# Altium project fmuvxX-baseT1.PrjPCB (part 1 of 3)
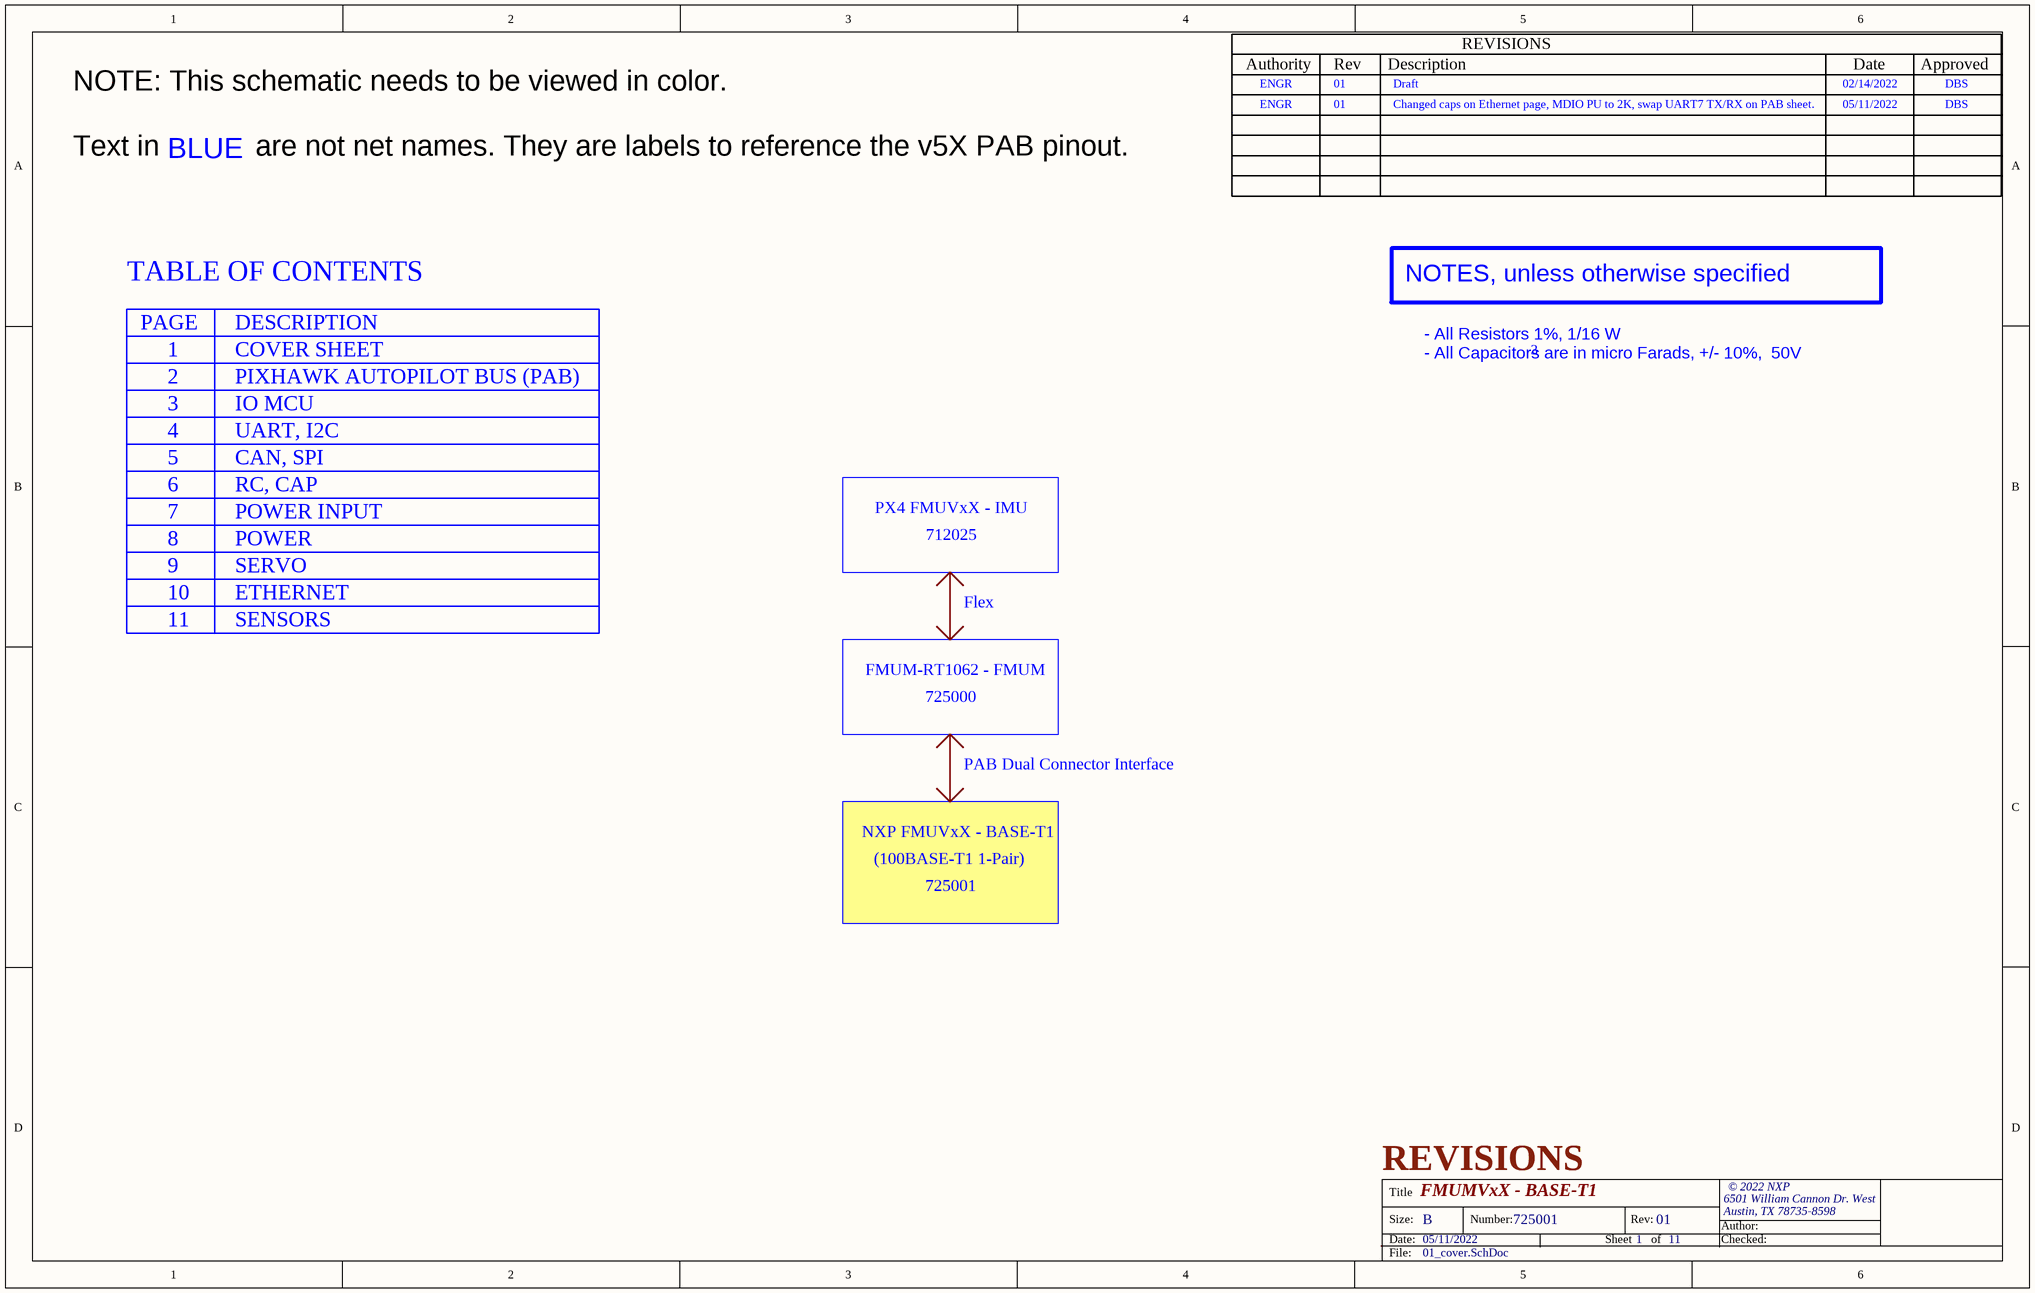
[diagram p0: 01_cover.SchDoc]
Proj_Title: FMUMVxX - BASE-T1; Proj_SheetTotal: 11; Proj_Revision: 01; Proj_Org_Address2: Austin, TX 78735-8598; Proj_Org_Address1: 6501 William Cannon Dr. West; Proj_Organization: © 2022 NXP; Proj_Number: 725001; Proj_Date: 05/11/2022; Proj_Checked: David Sidrane; Proj_Author: Dugan Yoon
7 sheets, 219 parts. Net scope: global (net labels, ports and power ports of the same name join across sheets).
Board file: fmuvxX-baseT1.PcbDoc
Sheets:
  01_cover.SchDoc
  02_PAB.SchDoc
  03_io_mcu.SchDoc
  05_can_spi.SchDoc
  08_power.SchDoc
  09_servo.SchDoc
  10_ethernet.SchDoc

## Sheet 01_cover.SchDoc: =Proj_Title
size B; Date: 05/11/2022; CheckedBy: David Sidrane; Author: Dugan Yoon; Organization: © 2022 NXP; Address1: Haleiwa, HI 96712 USA; DocumentNumber: 725001; Revision: 01; SheetNumber: 1; SheetTotal: 11

### Parts
*  REVISION_BLOCK  (value not drawn)  (graphical)

### Notes on the sheet
- (near *) ENGR
- 01
- Draft
- 02/14/2022
- DBS
- ENGR
- Changed caps on Ethernet page, MDIO PU to 2K, swap UART7 TX/RX on PAB sheet.
- 05/11/2022
- (near *) NOTE: This schematic needs to be viewed in color.
  Text in            are not net names. They are labels to reference the v5X PAB pinout.
- BLUE
- TABLE OF CONTENTS
- NOTES, unless otherwise specified
- PAGE
- 1
- DESCRIPTION
- COVER SHEET
- 3
- 2
- PIXHAWK AUTOPILOT BUS (PAB)
- IO MCU
- - All Resistors 1%, 1/16 W
  - All Capacitors are in micro Farads, +/- 10%,  50V
- 4
- 5
- 6
- UART, I2C
- CAN, SPI
- RC, CAP
- 7
- 8
- POWER INPUT
- POWER
- PX4 FMUVxX - IMU
- 712025
- 9
- 10
- 11
- SERVO
- ETHERNET
- SENSORS
- Flex
- FMUM-RT1062 - FMUM
- 725000
- PAB Dual Connector Interface
- NXP FMUVxX - BASE-T1
- (100BASE-T1 1-Pair)
- 725001
- REVISIONS
- Title
- Size:
- Date:
- B
- Number:
- Sheet
- Rev:
- of
- Author:
- Checked:
- File:
- (in symbol REVISION_BLOCK) REVISIONS; Authority; Rev; Description; Date; Approved

## Sheet 02_PAB.SchDoc: =Proj_Title
size B; Date: 05/11/2022; CheckedBy: David Sidrane; Author: Dugan Yoon; Organization: © 2022 NXP; Address1: Haleiwa, HI 96712 USA; DocumentNumber: 725001; Revision: 01; SheetNumber: 2; SheetTotal: 11
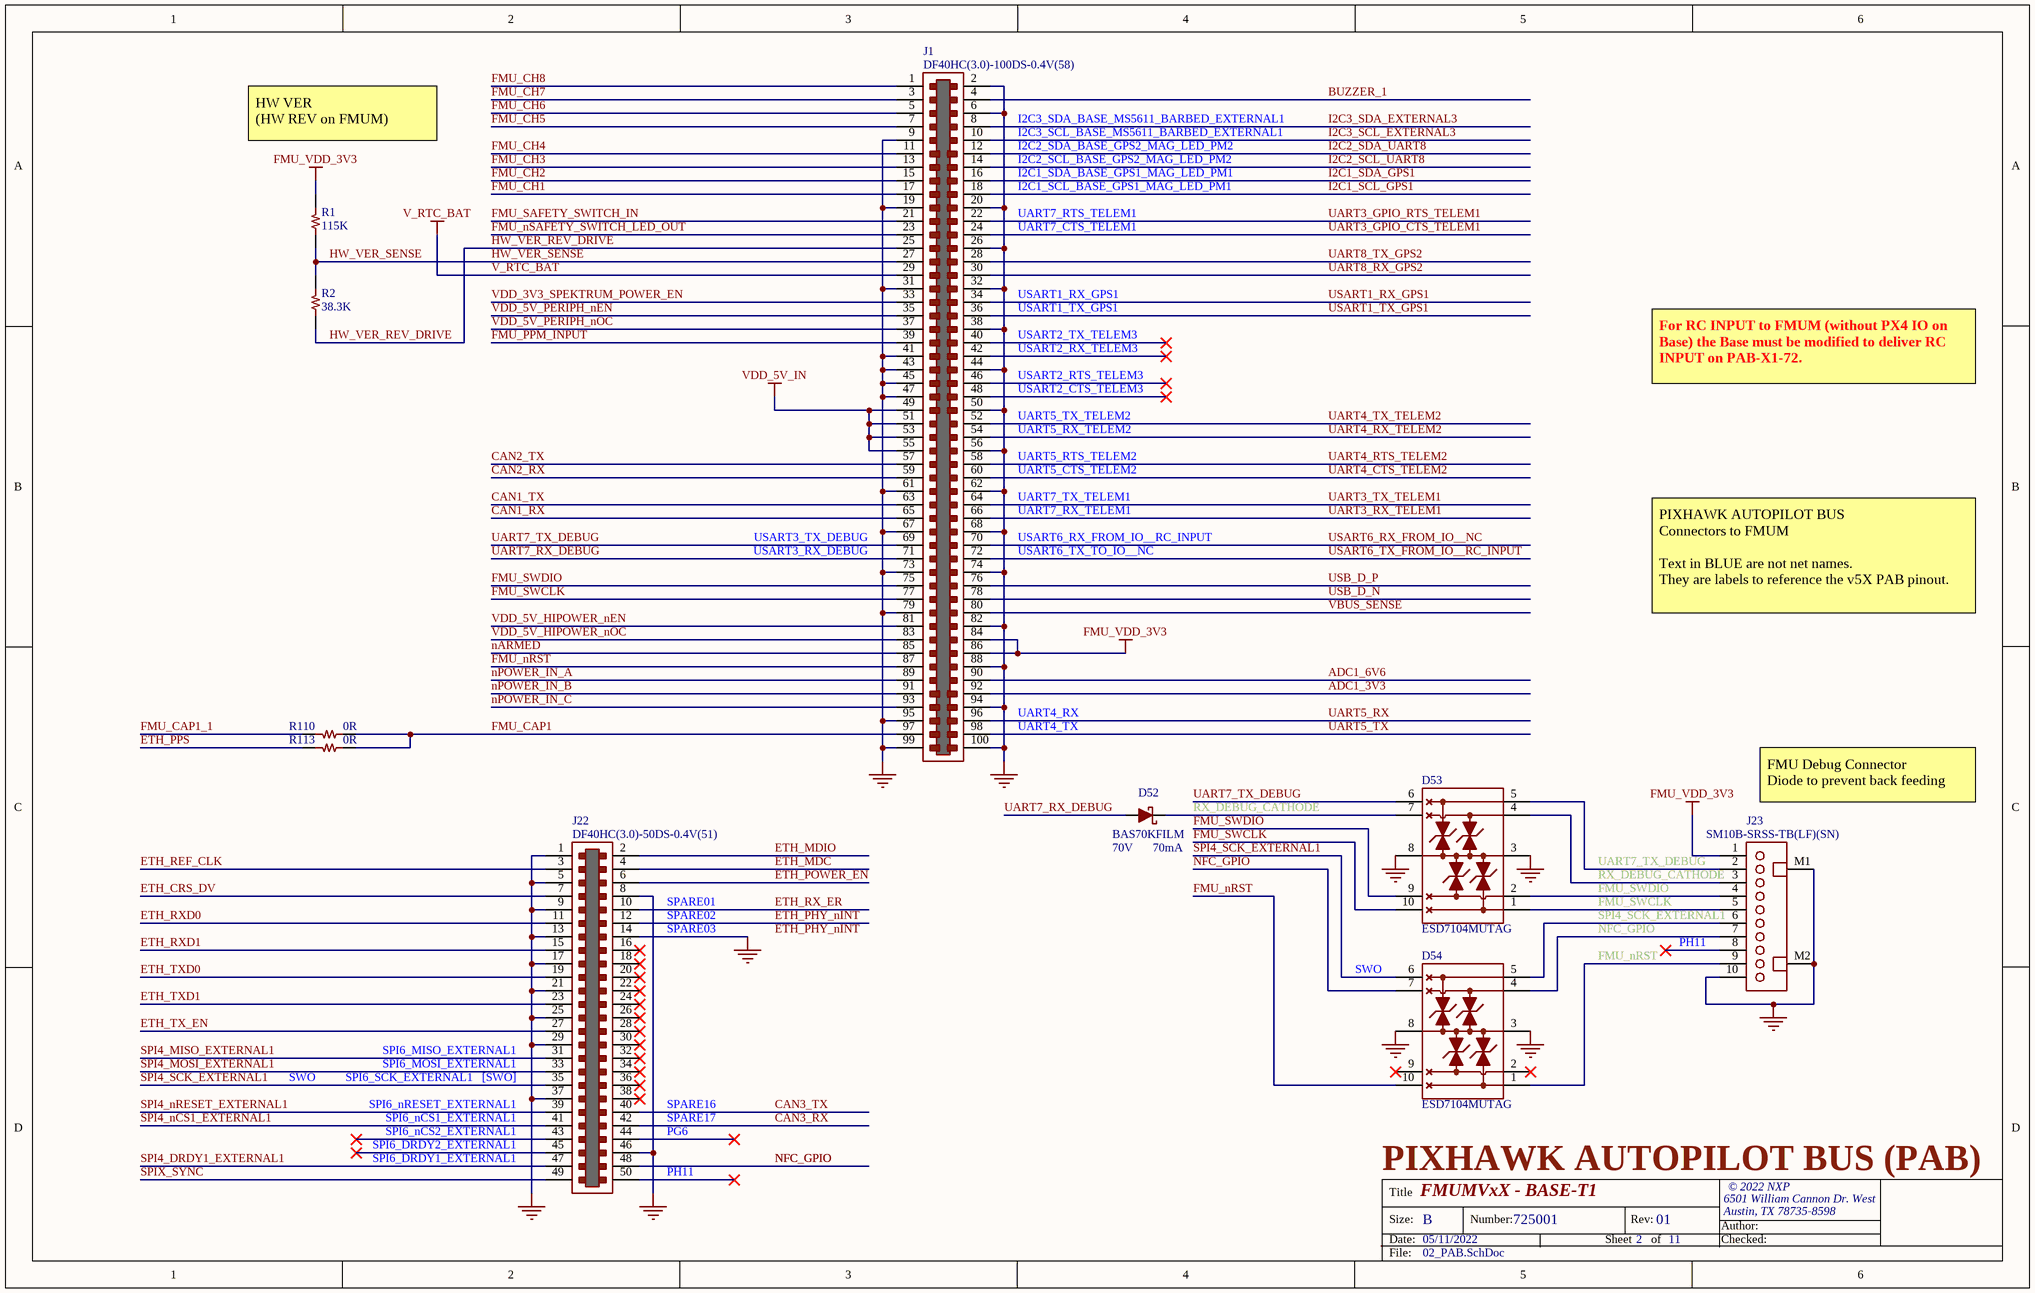
[diagram p1: 02_PAB.SchDoc]

### Parts
D52  Manufacturer Part Number: BAS70KFILM  Current: 70mA  Voltage: 70V  [SODFL120X80X70L30X30]  (hidden comment: DIODE SCHOTTKY 70V 70MA SOD523)
D53  Manufacturer Part Number: ESD7104MUTAG  [UDFN10P50_250X100X55L35X20N]  (hidden comment: DIODE TVS BIDIRECTIONAL 5V 10V 10UDFN)
D54  Manufacturer Part Number: ESD7104MUTAG  [UDFN10P50_250X100X55L35X20N]  (hidden comment: DIODE TVS BIDIRECTIONAL 5V 10V 10UDFN)
J1  Manufacturer Part Number: DF40HC(3.0)-100DS-0.4V(58)  [HIROSE_DF40HC3_0-100DS-0_4V51]  (hidden comment: CONN RCPT 100POS 0.4MM SMD GOLD)
J22  Manufacturer Part Number: DF40HC(3.0)-50DS-0.4V(51)  [HIROSE_DF40C-50DS-0-4V51]  (hidden comment: CONN RCPT 50POS 0.4MM SMD GOLD)
J23  Manufacturer Part Number: SM10B-SRSS-TB(LF)(SN)  [JST_SM10B-SRSS-TB]  (hidden comment: CONN HEADER SH 10POS SIDE 1MM SMT)
R1  value 115K  [RESC100X50X40L25]  (hidden comment: RES SMD 115K OHM 1% 1/16W 0402)
R2  value 38.3K  [RESC100X50X40L25]  (hidden comment: RES SMD 38.3K OHM 1% 1/16W 0402)
R110  value 0R  [RESC100X50X40L25]  (hidden comment: RES SMD 0 OHM 1% 1/16W 0402)
R113  value 0R  [RESC100X50X40L25]  (hidden comment: RES SMD 0 OHM 1% 1/16W 0402)

### Nets
FMU_VDD_3V3: J1.84 J1.86 J23.1 R1.1
GND: D53.3(GND) D53.8(GND) D54.3(GND) D54.8(GND) J1.2 J1.6 J1.9 J1.19 J1.20 J1.26 J1.31 J1.32 J1.38 J1.41 J1.43 J1.44 J1.45 J1.47 J1.50 J1.56 J1.61 J1.62 J1.67 J1.68 J1.73 J1.74 J1.79 J1.82 J1.88 J1.94 J1.95 J1.99 J1.100 J22.1 J22.5 J22.8 J22.9 J22.13 J22.14 J22.17 J22.21 J22.25 J22.29 J22.37 J22.46 J23.10 J23.M1 J23.M2
V_RTC_BAT: J1.29
VDD_5V_IN: J1.49 J1.51 J1.53 J1.55
ADC1_3V3: J1.92
ADC1_6V6: J1.90
BUZZER_1: J1.4
CAN1_RX: J1.65
CAN1_TX: J1.63
CAN2_RX: J1.59
CAN2_TX: J1.57
CAN3_RX: J22.42
CAN3_TX: J22.40
ETH_CRS_DV: J22.7
ETH_MDC: J22.4
ETH_MDIO: J22.2
ETH_PHY_nINT: J22.12
ETH_POWER_EN: J22.6
ETH_PPS: R113.1
ETH_REF_CLK: J22.3
ETH_RX_ER: J22.10
ETH_RXD0: J22.11
ETH_RXD1: J22.15
ETH_TX_EN: J22.27
ETH_TXD0: J22.19
ETH_TXD1: J22.23
FMU_CAP1: J1.97 R110.2 R113.2
FMU_CAP1_1: R110.1
FMU_CH1: J1.17
FMU_CH2: J1.15
FMU_CH3: J1.13
FMU_CH4: J1.11
FMU_CH5: J1.7
FMU_CH6: J1.5
FMU_CH7: J1.3
FMU_CH8: J1.1
FMU_nRST: D54.1 D54.10(NC) J1.87 J23.9
FMU_nSAFETY_SWITCH_LED_OUT: J1.23
FMU_PPM_INPUT: J1.39
FMU_SAFETY_SWITCH_IN: J1.21
FMU_SWCLK: D53.1 D53.10(NC) J1.77 J23.5
FMU_SWDIO: D53.2 D53.9(NC) J1.75 J23.4
HW_VER_REV_DRIVE: J1.25 R2.2
HW_VER_SENSE: J1.27 R1.2 R2.1
I2C1_SCL_GPS1: J1.18
I2C1_SDA_GPS1: J1.16
I2C2_SCL_UART8: J1.14
I2C2_SDA_UART8: J1.12
I2C3_SCL_EXTERNAL3: J1.10
I2C3_SDA_EXTERNAL3: J1.8
nARMED: J1.85
NFC_GPIO: D54.4 D54.7(NC) J22.48 J23.7
nPOWER_IN_A: J1.89
nPOWER_IN_B: J1.91
nPOWER_IN_C: J1.93
RX_DEBUG_CATHODE: D52.C D53.4 D53.7(NC) J23.3
SPI4_DRDY1_EXTERNAL1: J22.47
SPI4_MISO_EXTERNAL1: J22.31
SPI4_MOSI_EXTERNAL1: J22.33
SPI4_nCS1_EXTERNAL1: J22.41
SPI4_nRESET_EXTERNAL1: J22.39
SPI4_SCK_EXTERNAL1: D54.5 D54.6(NC) J22.35 J23.6
SPIX_SYNC: J22.49
UART3_GPIO_CTS_TELEM1: J1.24
UART3_GPIO_RTS_TELEM1: J1.22
UART3_RX_TELEM1: J1.66
UART3_TX_TELEM1: J1.64
UART4_CTS_TELEM2: J1.60
UART4_RTS_TELEM2: J1.58
UART4_RX_TELEM2: J1.54
UART4_TX_TELEM2: J1.52
UART5_RX: J1.96
UART5_TX: J1.98
UART7_RX_DEBUG: D52.A J1.71
UART7_TX_DEBUG: D53.5 D53.6(NC) J1.69 J23.2
UART8_RX_GPS2: J1.30
UART8_TX_GPS2: J1.28
USART1_RX_GPS1: J1.34
USART1_TX_GPS1: J1.36
USART6_RX_FROM_IO__NC: J1.70
USART6_TX_FROM_IO__RC_INPUT: J1.72
USB_D_N: J1.78
USB_D_P: J1.76
VBUS_SENSE: J1.80
VDD_3V3_SPEKTRUM_POWER_EN: J1.33
VDD_5V_HIPOWER_nEN: J1.81
VDD_5V_HIPOWER_nOC: J1.83
VDD_5V_PERIPH_nEN: J1.35
VDD_5V_PERIPH_nOC: J1.37

Not connected (* = marked no-connect by the designer): D54 2* 9(NC)*; J1 40* 42* 46* 48*; J22 16* 18* 20* 22* 24* 26* 28* 30* 32* 34* 36* 38* 43* 44* 45* 50*; J23 8*

### Notes on the sheet
- HW VER
  (HW REV on FMUM)
- I2C3_SDA_BASE_MS5611_BARBED_EXTERNAL1
- I2C3_SCL_BASE_MS5611_BARBED_EXTERNAL1
- I2C2_SDA_BASE_GPS2_MAG_LED_PM2
- I2C2_SCL_BASE_GPS2_MAG_LED_PM2
- UART7_RTS_TELEM1
- I2C1_SDA_BASE_GPS1_MAG_LED_PM1
- I2C1_SCL_BASE_GPS1_MAG_LED_PM1
- UART7_CTS_TELEM1
- USART1_RX_GPS1
- USART1_TX_GPS1
- USART2_TX_TELEM3
- USART2_RX_TELEM3
- USART2_RTS_TELEM3
- USART2_CTS_TELEM3
- UART5_TX_TELEM2
- UART5_RX_TELEM2
- For RC INPUT to FMUM (without PX4 IO on Base) the Base must be modified to deliver RC INPUT on PAB-X1-72.
- UART5_RTS_TELEM2
- UART5_CTS_TELEM2
- UART7_TX_TELEM1
- USART3_TX_DEBUG
- USART3_RX_DEBUG
- UART7_RX_TELEM1
- USART6_RX_FROM_IO__RC_INPUT
- USART6_TX_TO_IO__NC
- PIXHAWK AUTOPILOT BUS
  Connectors to FMUM
  Text in BLUE are not net names.
  They are labels to reference the v5X PAB pinout.
- UART4_RX
- UART4_TX
- FMU Debug Connector
  Diode to prevent back feeding
- SPARE01
- SPARE02
- SPARE03
- SWO
- (near J23) PH11
- SPI6_MISO_EXTERNAL1
- SPI6_MOSI_EXTERNAL1
- SPI6_SCK_EXTERNAL1   [SWO]
- SPI6_nRESET_EXTERNAL1
- SPARE16
- SPI6_nCS1_EXTERNAL1
- SPI6_nCS2_EXTERNAL1
- SPI6_DRDY2_EXTERNAL1
- SPI6_DRDY1_EXTERNAL1
- SPARE17
- PG6
- PH11
- PIXHAWK AUTOPILOT BUS (PAB)
- Labels drawn without touching a wire or pin: ETH_PHY_nINT
- Title
- Size:
- Date:
- B
- Number:
- Sheet
- Rev:
- of
- Author:
- Checked:
- File:

### Library data of the parts
D52 = DIODE_SCHOTTKY_BAS70_SOD523_SMT: Manufacturer: STMicroelectronics; Packaging: Cut Tape (CT); Part Status: Active; Supplier 1: Digi-Key; Supplier Part Number 1: 497-5695-1-ND; Category: Discrete Semiconductor Products; Stock 1: 20067; Pricing 1: 1=0.28, 10=0.23, 100=0.122, 500=0.08028, 1000=0.05459 (USD); ComponentLink1Description: https://www.digikey.com/product-detail/en/stmicroelectronics/BAS70KFILM/497-5695-1-ND/1299948; ComponentLink1URL: https://www.digikey.com/product-detail/en/stmicroelectronics/BAS70KFILM/497-5695-1-ND/1299948
D53 D54 = DIODE_TVS_4X_10UDFN: Manufacturer: ON Semiconductor; Packaging: Cut Tape (CT); Part Status: Active; Operating Temperature: -55°C ~ 125°C (TJ); Supplier 1: Digi-Key; Supplier Part Number 1: ESD7104MUTAGOSCT-ND; Category: Circuit Protection; Stock 1: 5750; Pricing 1: 1=0.63, 10=0.541, 100=0.40370, 500=0.31716, 1000=0.24508 (USD); ComponentLink1Description: https://www.digikey.com/product-detail/en/on-semiconductor/ESD7104MUTAG/ESD7104MUTAGOSCT-ND/3487538; ComponentLink1URL: https://www.digikey.com/product-detail/en/on-semiconductor/ESD7104MUTAG/ESD7104MUTAGOSCT-ND/3487538
J1 = CONN_RCPT_2X50_RECPT_0.4MM_SMD: Manufacturer: Hirose Electric Co Ltd; Number of Positions: 100; Pitch: 0.016" (0.40mm); System: Connector; Mated Stacking Heights: 3mm; Packaging: Cut Tape (CT); Part Status: Active; Number of Rows: 2; Mounting Type: Surface Mount; Operating Temperature: -65°C ~ 85°C; Supplier 1: Digi-Key; Supplier Part Number 1: H124602CT-ND; Category: Connectors, Interconnects; Stock 1: 2220; Pricing 1: 1=2.75 (USD); ComponentLink1Description: https://www.digikey.com/products/en/connectors-interconnects/rectangular-connectors-arrays-edge-type-mezzanine-board-to-board/308?k=df40hc%283.0%29-100&k=&pkeyword=df40hc%283.0%29-100&sv=0&pv7=2&sf=0&quantity=&ColumnSort=0&page=1&pageSize=25; ComponentLink1URL: https://www.digikey.com/products/en/connectors-interconnects/rectangular-connectors-arrays-edge-type-mezzanine-board-to-board/308?k=df40hc%283.0%29-100&k=&pkeyword=df40hc%283.0%29-100&sv=0&pv7=2&sf=0&quantity=&ColumnSort=0&page=1&pageSize=25
J22 = CONN_RCPT_2X25_RECPT_0.4MM_SMD: Manufacturer: Hirose Electric Co Ltd; Number of Positions: 50; Pitch: 0.016" (0.40mm); System: Connector; Mated Stacking Heights: 3mm; Packaging: Cut Tape (CT); Part Status: Active; Number of Rows: 2; Mounting Type: Surface Mount; Operating Temperature: -65°C ~ 85°C; Supplier 1: Digi-Key; Supplier Part Number 1: H11915CT-ND; Category: Connectors, Interconnects; Stock 1: 8712; Pricing 1: 1=1.05, 10=0.926, 25=0.8712, 50=0.835, 100=0.7986, 250=0.726, 500=0.6534, 1000=0.5808 (USD); ComponentLink1Description: https://www.digikey.com/products/en/connectors-interconnects/rectangular-connectors-arrays-edge-type-mezzanine-board-to-board/308?k=DF40HC%283.0%29-50DS-0.4V%2851%29&k=&pkeyword=DF40HC%283.0%29-50DS-0.4V%2851%29&sv=0&pv7=2&sf=0&quantity=&ColumnSort=0&page=1&pageSize=25; ComponentLink1URL: https://www.digikey.com/products/en/connectors-interconnects/rectangular-connectors-arrays-edge-type-mezzanine-board-to-board/308?k=DF40HC%283.0%29-50DS-0.4V%2851%29&k=&pkeyword=DF40HC%283.0%29-50DS-0.4V%2851%29&sv=0&pv7=2&sf=0&quantity=&ColumnSort=0&page=1&pageSize=25
J23 = CONN_JST_SH_10PIN_RA_SMT: Manufacturer: JST Sales America Inc.; Voltage - Rated: 50V; System: Connector; Packaging: Cut Tape (CT); Part Status: Active; Operating Temperature: -25°C ~ 85°C; Supplier 1: Digi-Key; Supplier Part Number 1: 455-1810-1-ND; Category: Connectors, Interconnects; Stock 1: 62595; Pricing 1: 1=1.06, 10=9.32, 100=0.8037, 500=0.65758, 1000=0.58452 (USD); ComponentLink1Description: https://www.digikey.com/products/en/connectors-interconnects/rectangular-connectors-headers-male-pins/314?k=SM10B-SRSS&k=&pkeyword=SM10B-SRSS&pv1989=0&sf=0&FV=ffe0013a%2C1c0002&quantity=&ColumnSort=0&page=1&pageSize=25; ComponentLink1URL: https://www.digikey.com/products/en/connectors-interconnects/rectangular-connectors-headers-male-pins/314?k=SM10B-SRSS&k=&pkeyword=SM10B-SRSS&pv1989=0&sf=0&FV=ffe0013a%2C1c0002&quantity=&ColumnSort=0&page=1&pageSize=25
R1 = RES_115K_1%_1/16W_0402: Manufacturer: Vishay Dale; Manufacturer Part Number: CRCW0402115KFKED; Packaging: Cut Tape (CT); Part Status: Active; Tolerance: ±1%; Operating Temperature: -55°C ~ 155°C; Supplier 1: Digi-Key; Supplier Part Number 1: 541-115KLCT-ND; Category: Resistors; Stock 1: 32374; Pricing 1: 1=0.1, 10=0.014, 100=0.0056, 1000=0.00253, 2500=0.0022, 5000=0.00181 (USD); Power: 1/16W; ComponentLink1Description: https://www.digikey.com/products/en/resistors/chip-resistor-surface-mount/52?k=&pkeyword=&sv=0&v=541&pv2085=u115+kOhms&sf=0&FV=2%7C7854%2C3%7C1131%2C7%7C2%2C1989%7C0%2C-8%7C52%2C174%7C411742&quantity=&ColumnSort=0&page=1&pageSize=25; ComponentLink1URL: https://www.digikey.com/products/en/resistors/chip-resistor-surface-mount/52?k=&pkeyword=&sv=0&v=541&pv2085=u115+kOhms&sf=0&FV=2%7C7854%2C3%7C1131%2C7%7C2%2C1989%7C0%2C-8%7C52%2C174%7C411742&quantity=&ColumnSort=0&page=1&pageSize=25
R2 = RES_38.3K_1%_1/16W_0402: Manufacturer: Yageo; Manufacturer Part Number: RC0402FR-0738K3L; Packaging: Cut Tape (CT); Part Status: Active; Tolerance: ±1%; Operating Temperature: -55°C ~ 155°C; Supplier 1: Digi-Key; Supplier Part Number 1: YAG3141CT-ND; Category: Resistors; Stock 1: 92389; Pricing 1: 1=0.1, 10=0.014, 100=0.0056, 1000=0.00253, 2500=0.0022, 5000=0.00181 (USD); Power: 1/16W; ComponentLink1Description: https://www.digikey.com/products/en/resistors/chip-resistor-surface-mount/52?k=RC0402FR-0738K3L&k=&pkeyword=RC0402FR-0738K3L&sv=0&pv7=2&sf=0&quantity=&ColumnSort=0&page=1&pageSize=25; ComponentLink1URL: https://www.digikey.com/products/en/resistors/chip-resistor-surface-mount/52?k=RC0402FR-0738K3L&k=&pkeyword=RC0402FR-0738K3L&sv=0&pv7=2&sf=0&quantity=&ColumnSort=0&page=1&pageSize=25
R110 R113 = RES_0R_1%_1/16W_0402: Manufacturer: Yageo; Manufacturer Part Number: RC0402JR-070RL; Packaging: Cut Tape (CT); Part Status: Active; Tolerance: ±1%; Operating Temperature: -55°C ~ 155°C; Supplier 1: Digi-Key; Supplier Part Number 1: 311-0.0JRCT-ND; Category: Resistors; Stock 1: 34962204; Pricing 1: 1=0.1, 10=0.014, 100=0.0056, 1000=0.00253, 2500=0.0022, 5000=0.00181 (USD); Power: 1/16W; ComponentLink1Description: https://www.digikey.com/product-detail/en/yageo/RC0402JR-070RL/311-0.0JRCT-ND/729353; ComponentLink1URL: https://www.digikey.com/product-detail/en/yageo/RC0402JR-070RL/311-0.0JRCT-ND/729353

## Sheet 03_io_mcu.SchDoc: =Proj_Title
size B; Date: 05/11/2022; CheckedBy: David Sidrane; Author: Dugan Yoon; Organization: © 2022 NXP; Address1: Giesshuebelstrasse 40; Address2: 8045 Zurich, Switzerland; DocumentNumber: 725001; Revision: 01; SheetNumber: 3; SheetTotal: 11
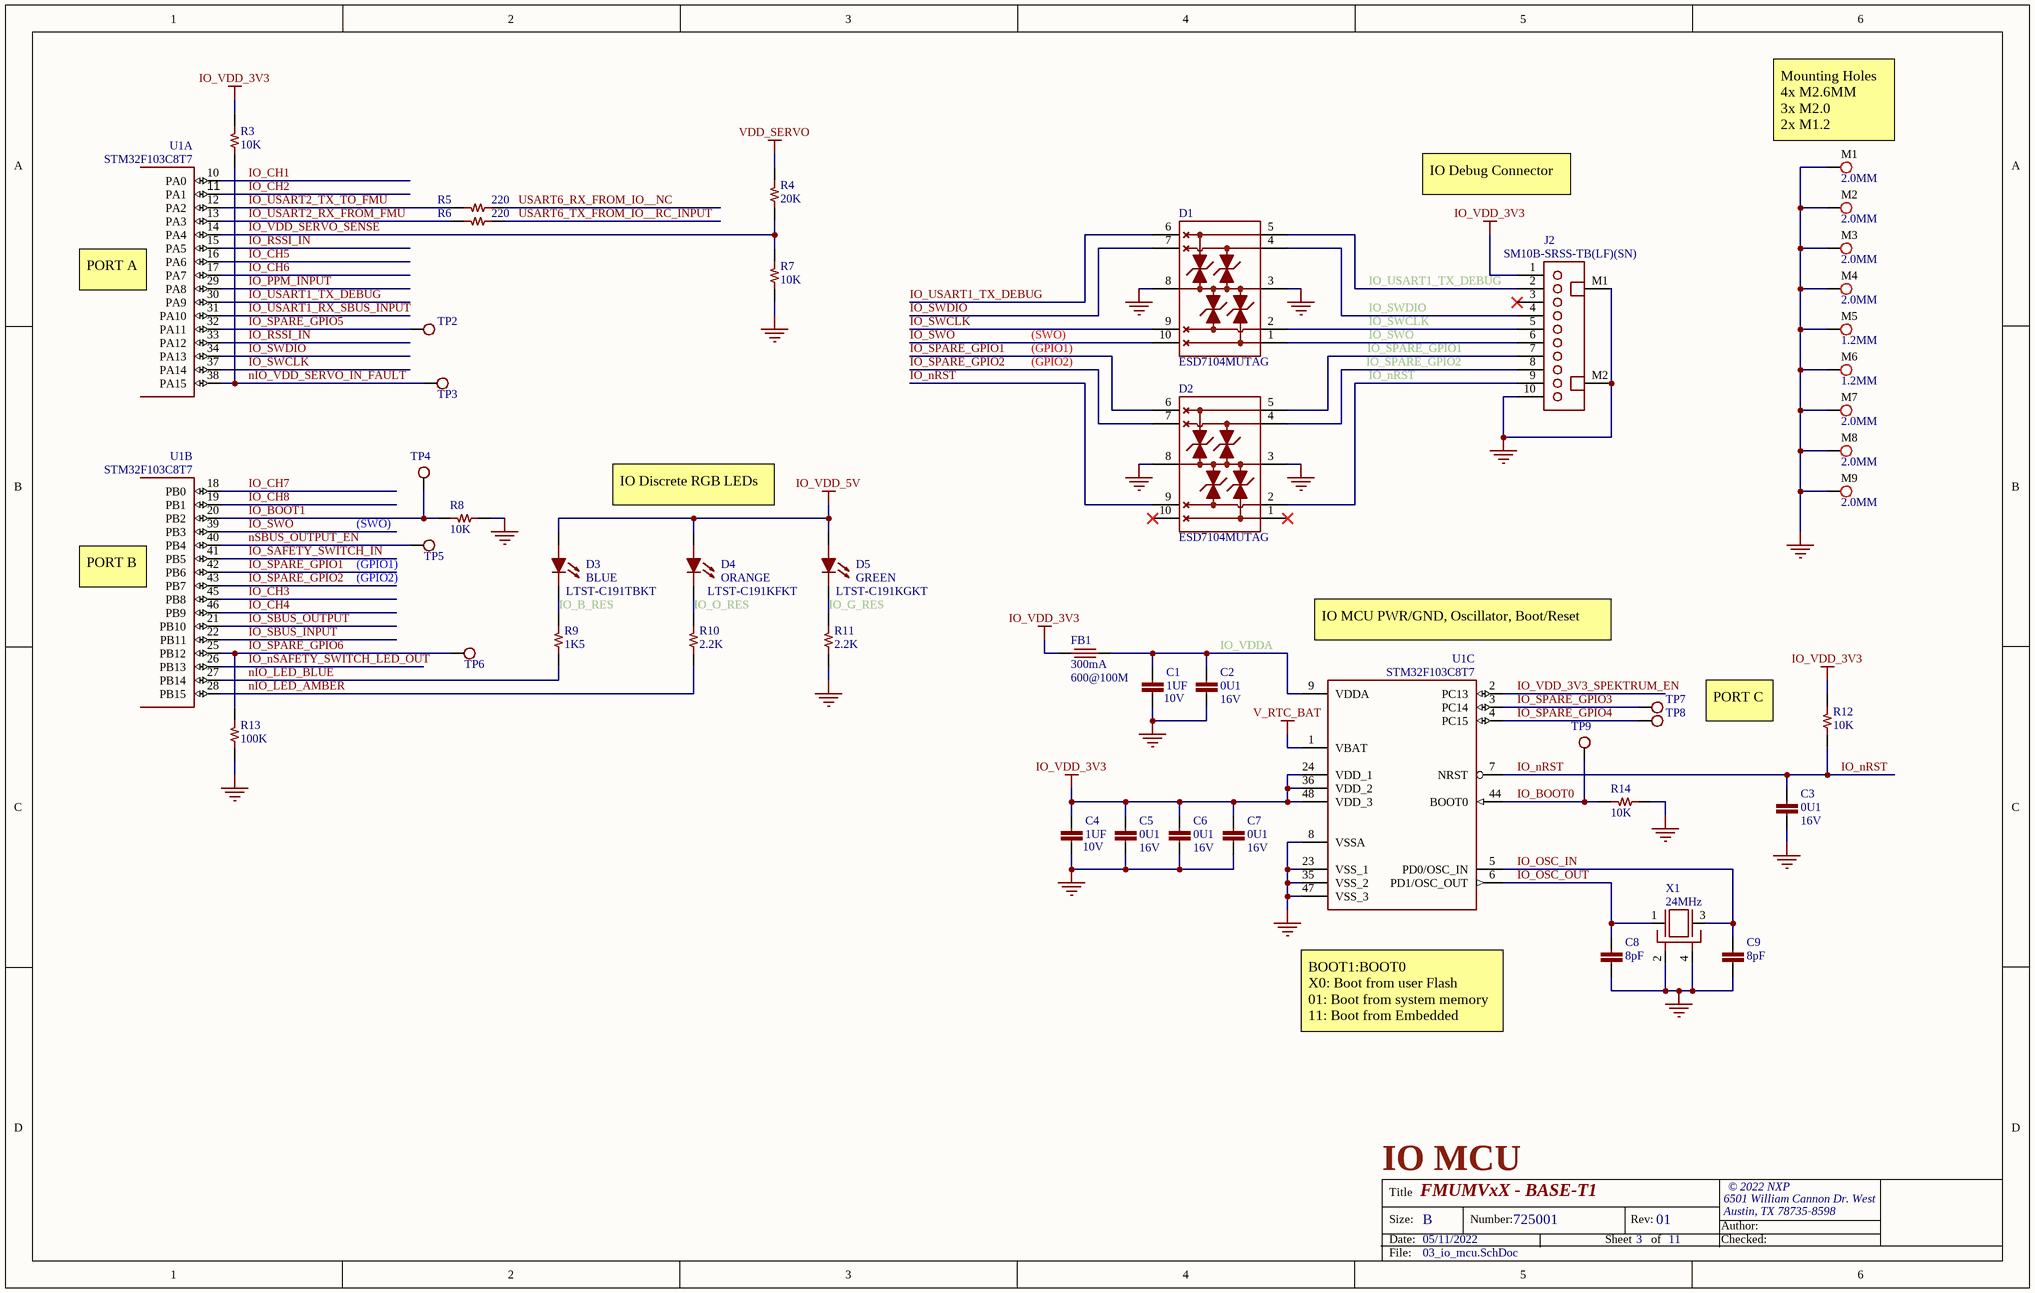
[diagram p2: 03_io_mcu.SchDoc]

### Parts
C1  value 1UF  Voltage - Rated: 10V  [CAPC100X50X56L25N]  (hidden comment: CAP CER 1UF 20% 10V X5R 0402)
C2  value 0U1  Voltage - Rated: 16V  [CAPC100X50X56L25N]  (hidden comment: CAP CER 0.1UF 10% 16V X7R 0402)
C3  value 0U1  Voltage - Rated: 16V  [CAPC100X50X56L25N]  (hidden comment: CAP CER 0.1UF 10% 16V X7R 0402)
C4  value 1UF  Voltage - Rated: 10V  [CAPC100X50X56L25N]  (hidden comment: CAP CER 1UF 20% 10V X5R 0402)
C5  value 0U1  Voltage - Rated: 16V  [CAPC100X50X56L25N]  (hidden comment: CAP CER 0.1UF 10% 16V X7R 0402)
C6  value 0U1  Voltage - Rated: 16V  [CAPC100X50X56L25N]  (hidden comment: CAP CER 0.1UF 10% 16V X7R 0402)
C7  value 0U1  Voltage - Rated: 16V  [CAPC100X50X56L25N]  (hidden comment: CAP CER 0.1UF 10% 16V X7R 0402)
C8  value 8pF  [CAPC100X50X56L25N]  (hidden comment: CAP CER 8PF 50V C0G/NP0 0402)
C9  value 8pF  [CAPC100X50X56L25N]  (hidden comment: CAP CER 8PF 50V C0G/NP0 0402)
D1  Manufacturer Part Number: ESD7104MUTAG  [UDFN10P50_250X100X55L35X20N]  (hidden comment: DIODE TVS BIDIRECTIONAL 5V 10V 10UDFN)
D2  Manufacturer Part Number: ESD7104MUTAG  [UDFN10P50_250X100X55L35X20N]  (hidden comment: DIODE TVS BIDIRECTIONAL 5V 10V 10UDFN)
D3  Color: BLUE  Manufacturer Part Number: LTST-C191TBKT  [LEDSC80X160X65L40N_BLU]  (hidden comment: LED BLUE CLEAR 0603 SMD)
D4  Color: ORANGE  Manufacturer Part Number: LTST-C191KFKT  [LEDSC80X160X65L40N_ORA]  (hidden comment: LED ORANGE CLEAR 0603 SMD)
D5  Color: GREEN  Manufacturer Part Number: LTST-C191KGKT  [LEDSC80X160X65L40N_GRN]  (hidden comment: LED GREEN CLEAR 0603 SMD)
FB1  value 600@100M  Current: 300mA  [BEADC100X50X55L25]  (hidden comment: IND FERRITE 600@100M 300mA 0402)
J2  Manufacturer Part Number: SM10B-SRSS-TB(LF)(SN)  [JST_SM10B-SRSS-TB]  (hidden comment: CONN HEADER SH 10POS SIDE 1MM SMT)
M1  ID: 2.0MM  [MOUNT_HOLE_2MM_3.6MM_8via_TH]  (hidden comment: MOUNT HOLE 2MM 3.6MM 8VIAS TH)  (no BOM)
M2  ID: 2.0MM  [MOUNT_HOLE_2MM_3.6MM_8via_TH]  (hidden comment: MOUNT HOLE 2MM 3.6MM 8VIAS TH)  (no BOM)
M3  ID: 2.0MM  [MOUNT_HOLE_2MM_3.6MM_8via_TH]  (hidden comment: MOUNT HOLE 2MM 3.6MM 8VIAS TH)  (no BOM)
M4  ID: 2.0MM  [MOUNT_HOLE_2MM_3.6MM_8via_TH]  (hidden comment: MOUNT HOLE 2MM 3.6MM 8VIAS TH)  (no BOM)
M5  ID: 1.2MM  [MOUNT_HOLE_1.2MM_TH]  (hidden comment: MOUNT HOLE 1.2MM TH)  (no BOM)
M6  ID: 1.2MM  [MOUNT_HOLE_1.2MM_TH]  (hidden comment: MOUNT HOLE 1.2MM TH)  (no BOM)
M7  ID: 2.0MM  [MOUNT_HOLE_2MM_3.6MM_8via_TH]  (hidden comment: MOUNT HOLE 2MM 3.6MM 8VIAS TH)  (no BOM)
M8  ID: 2.0MM  [MOUNT_HOLE_2MM_3.6MM_8via_TH]  (hidden comment: MOUNT HOLE 2MM 3.6MM 8VIAS TH)  (no BOM)
M9  ID: 2.0MM  [MOUNT_HOLE_2MM_3.6MM_8via_TH]  (hidden comment: MOUNT HOLE 2MM 3.6MM 8VIAS TH)  (no BOM)
R3  value 10K  [RESC100X50X40L25]  (hidden comment: RES SMD 10K OHM 1% 1/16W 0402)
R4  value 20K  [RESC100X50X40L25]  (hidden comment: RES SMD 20K OHM 1% 1/16W 0402)
R5  value 220  [RESC100X50X40L25]  (hidden comment: RES SMD 220 OHM 1% 1/16W 0402)
R6  value 220  [RESC100X50X40L25]  (hidden comment: RES SMD 220 OHM 1% 1/16W 0402)
R7  value 10K  [RESC100X50X40L25]  (hidden comment: RES SMD 10K OHM 1% 1/16W 0402)
R8  value 10K  [RESC100X50X40L25]  (hidden comment: RES SMD 10K OHM 1% 1/16W 0402)
R9  value 1K5  [RESC100X50X40L25]  (hidden comment: RES SMD 1.5K OHM 1% 1/16W 0402)
R10  value 2.2K  [RESC100X50X40L25]  (hidden comment: RES SMD 2.2K OHM 1% 1/16W 0402)
R11  value 2.2K  [RESC100X50X40L25]  (hidden comment: RES SMD 2.2K OHM 1% 1/16W 0402)
R12  value 10K  [RESC100X50X40L25]  (hidden comment: RES SMD 10K OHM 1% 1/16W 0402)
R13  value 100K  [RESC100X50X40L25]  (hidden comment: RES SMD 100K OHM 1% 1/16W 0402)
R14  value 10K  [RESC100X50X40L25]  (hidden comment: RES SMD 10K OHM 1% 1/16W 0402)
TP2  TESTPOINT PAD SMD  [TEST_PAD_1MM]  (value not drawn)  (no BOM)
TP3  TESTPOINT PAD SMD  [TEST_PAD_1MM]  (value not drawn)  (no BOM)
TP4  TESTPOINT PAD SMD  [TEST_PAD_1MM]  (value not drawn)  (no BOM)
TP5  TESTPOINT PAD SMD  [TEST_PAD_1MM]  (value not drawn)  (no BOM)
TP6  TESTPOINT PAD SMD  [TEST_PAD_1MM]  (value not drawn)  (no BOM)
TP7  TESTPOINT PAD SMD  [TEST_PAD_1MM]  (value not drawn)  (no BOM)
TP8  TESTPOINT PAD SMD  [TEST_PAD_1MM]  (value not drawn)  (no BOM)
TP9  TESTPOINT PAD SMD  [TEST_PAD_1MM]  (value not drawn)  (no BOM)
U1  Manufacturer Part Number: STM32F103C8T7  [QFP48P50_900X900X160L60X22N]  (hidden comment: IC MCU 32BIT 64KB FLASH 48LQFP)  (parts A,B,C of 3)
X1  Frequency: 24MHz  [XTAL_4PIN_320X250X80]  (hidden comment: CRYSTAL 24.0000MHZ 8PF SMD)

### Nets
GND: C1.2 C2.2 C3.2 C4.2 C5.2 C6.2 C7.2 C8.2 C9.2 D1.3(GND) D1.8(GND) D2.3(GND) D2.8(GND) J2.10 J2.M1 J2.M2 M1.1 M2.1 M3.1 M4.1 M5.1 M6.1 M7.1 M8.1 M9.1 R7.2 R8.2 R11.2 R13.2 R14.2 U1.8(VSSA) U1.23(VSS_1) U1.35(VSS_2) U1.47(VSS_3) X1.2 X1.4
IO_VDD_3V3: C4.1 C5.1 C6.1 C7.1 FB1.1 J2.1 R3.1 R12.1 U1.24(VDD_1) U1.36(VDD_2) U1.48(VDD_3)
IO_VDD_5V: D3.A D4.A D5.A
V_RTC_BAT: U1.1(VBAT)
VDD_SERVO: R4.1
IO_B_RES: D3.C R9.1
IO_BOOT0: R14.1 TP9.1 U1.44(BOOT0)
IO_BOOT1: R8.1 TP4.1 U1.20(PB2)
IO_CH1: U1.10(PA0)
IO_CH2: U1.11(PA1)
IO_CH3: U1.45(PB8)
IO_CH4: U1.46(PB9)
IO_CH5: U1.16(PA6)
IO_CH6: U1.17(PA7)
IO_CH7: U1.18(PB0)
IO_CH8: U1.19(PB1)
IO_G_RES: D5.C R11.1
IO_nRST: C3.1 D2.2 D2.9(NC) J2.9 R12.2 U1.7(NRST)
IO_nSAFETY_SWITCH_LED_OUT: U1.26(PB13)
IO_O_RES: D4.C R10.1
IO_OSC_IN: C9.1 U1.5(PD0/OSC_IN) X1.3
IO_OSC_OUT: C8.1 U1.6(PD1/OSC_OUT) X1.1
IO_PPM_INPUT: U1.29(PA8)
IO_RSSI_IN: U1.15(PA5) U1.33(PA12)
IO_SAFETY_SWITCH_IN: U1.41(PB5)
IO_SBUS_INPUT: U1.22(PB11)
IO_SBUS_OUTPUT: U1.21(PB10)
IO_SPARE_GPIO1: D2.5 D2.6(NC) J2.7 U1.42(PB6)
IO_SPARE_GPIO2: D2.4 D2.7(NC) J2.8 U1.43(PB7)
IO_SPARE_GPIO3: TP7.1 U1.3(PC14)
IO_SPARE_GPIO4: TP8.1 U1.4(PC15)
IO_SPARE_GPIO5: TP2.1 U1.32(PA11)
IO_SPARE_GPIO6: R13.1 TP6.1 U1.25(PB12)
IO_SWCLK: D1.2 D1.9(NC) J2.5 U1.37(PA14)
IO_SWDIO: D1.4 D1.7(NC) J2.4 U1.34(PA13)
IO_SWO: D1.1 D1.10(NC) J2.6 U1.39(PB3)
IO_USART1_RX_SBUS_INPUT: U1.31(PA10)
IO_USART1_TX_DEBUG: D1.5 D1.6(NC) J2.2 U1.30(PA9)
IO_USART2_RX_FROM_FMU: R6.1 U1.13(PA3)
IO_USART2_TX_TO_FMU: R5.1 U1.12(PA2)
IO_VDD_3V3_SPEKTRUM_EN: U1.2(PC13)
IO_VDD_SERVO_SENSE: R4.2 R7.1 U1.14(PA4)
IO_VDDA: C1.1 C2.1 FB1.2 U1.9(VDDA)
nIO_LED_AMBER: R10.2 U1.28(PB15)
nIO_LED_BLUE: R9.2 U1.27(PB14)
nIO_VDD_SERVO_IN_FAULT: R3.2 TP3.1 U1.38(PA15)
nSBUS_OUTPUT_EN: TP5.1 U1.40(PB4)
USART6_RX_FROM_IO__NC: R5.2
USART6_TX_FROM_IO__RC_INPUT: R6.2

Not connected (* = marked no-connect by the designer): D2 1* 10(NC)*; J2 3*

### Notes on the sheet
- (near M1) Mounting Holes
  4x M2.6MM
  3x M2.0
  2x M1.2
- IO Debug Connector
- (near U1) PORT A
- (SWO)
- (GPIO2)
- (GPIO1)
- (near D4) IO Discrete RGB LEDs
- (near TP5) (GPIO1)
- (near U1) PORT B
- (near TP5) (GPIO2)
- IO MCU PWR/GND, Oscillator, Boot/Reset
- PORT C
- BOOT1:BOOT0
  X0: Boot from user Flash
  01: Boot from system memory
  11: Boot from Embedded SRAM
- IO MCU
- Title
- Size:
- Date:
- B
- Number:
- Sheet
- Rev:
- of
- Author:
- Checked:
- File:

### Library data of the parts
C1 C4 = CAP_1UF_20%_10V_X5R_0402: Manufacturer: Yageo; Manufacturer Part Number: CC0402MRX5R6BB105; Packaging: Tape & Reel (TR); Part Status: Active; Temperature Coefficient: X5R; Operating Temperature: -55°C ~ 85°C; Ratings: -; Supplier 1: Digi-Key; Supplier Part Number 1: 311-1732-1-ND; Category: Capacitors; Stock 1: 52516; Pricing 1: 1=0.22, 10=0.156, 100=0.0732, 10000=0.02925 (USD); ComponentLink1Description: https://www.digikey.com/product-detail/en/yageo/CC0402MRX5R6BB105/311-1732-1-ND/5195634; ComponentLink1URL: https://www.digikey.com/product-detail/en/yageo/CC0402MRX5R6BB105/311-1732-1-ND/5195634; Tolerance: ±20%
C2 C3 C5-C7 = CAP_0U1_16V_X7R_0402: Manufacturer: Murata Electronics; Manufacturer Part Number: GCM155R71C104KA55J; Packaging: Cut Tape (CT); Part Status: Active; Tolerance: ±10%; Operating Temperature: -55°C ~ 125°C; Supplier 1: Digi-Key; Supplier Part Number 1: 490-7998-1-ND; Category: Capacitors; Stock 1: 6381653; Pricing 1: 1=0.1, 10=0.049, 100=0.022, 500=0.0157, 1000=0.01233, 2500=0.01121, 5000=0.01032 (USD); ComponentLink1Description: https://www.digikey.com/product-detail/en/murata-electronics/GCM155R71C104KA55J/490-7998-1-ND/4380283; ComponentLink1URL: https://www.digikey.com/product-detail/en/murata-electronics/GCM155R71C104KA55J/490-7998-1-ND/4380283
C8 C9 = CAP_8PF_50V_NPO_0402: Manufacturer: Yageo; Manufacturer Part Number: CC0402DRNPO9BN8R0; Temperature Coefficient: C0G, NP0; Tolerance: ±0.5pF; Packaging: Cut Tape (CT); Part Status: Active; Operating Temperature: -55°C ~ 125°C; ComponentLink1URL: https://www.digikey.com/product-detail/en/yageo/CC0402DRNPO9BN8R0/311-1639-1-ND/5195541; ComponentLink1Description: https://www.digikey.com/product-detail/en/yageo/CC0402DRNPO9BN8R0/311-1639-1-ND/5195541; Supplier 1: Digi-Key; Supplier Part Number 1: 311-1639-1-ND; Category: Capacitors; Stock 1: 455831; Pricing 1: 1=0.1, 10=0.032, 100=0.0143, 500=0.0102, 1000=0.00802, 2500=0.00729, 5000=0.0067 (USD); Voltage - Rated: 50V
D1 D2 = DIODE_TVS_4X_10UDFN: Manufacturer: ON Semiconductor; Packaging: Cut Tape (CT); Part Status: Active; Operating Temperature: -55°C ~ 125°C (TJ); Supplier 1: Digi-Key; Supplier Part Number 1: ESD7104MUTAGOSCT-ND; Category: Circuit Protection; Stock 1: 5750; Pricing 1: 1=0.63, 10=0.541, 100=0.40370, 500=0.31716, 1000=0.24508 (USD); ComponentLink1Description: https://www.digikey.com/product-detail/en/on-semiconductor/ESD7104MUTAG/ESD7104MUTAGOSCT-ND/3487538; ComponentLink1URL: https://www.digikey.com/product-detail/en/on-semiconductor/ESD7104MUTAG/ESD7104MUTAGOSCT-ND/3487538
D3 = DIODE_LED_BLUE_0603: Manufacturer: Lite-On Inc.; Packaging: Cut Tape (CT); Part Status: Active; ComponentLink1URL: http://optoelectronics.liteon.com/upload/download/DS22-2000-228/LTST-C191KGKT.PDF; ComponentLink1Description: http://optoelectronics.liteon.com/upload/download/DS22-2000-228/LTST-C191KGKT.PDF; Supplier 1: Digi-Key; Supplier Part Number 1: 160-1647-1-ND; Category: Optoelectronics; Stock 1: 403566; Pricing 1: 1=0.53, 10=0.384, 25=0.2964, 100=0.196 (USD); ComponentLink2Description: https://www.digikey.com/product-detail/en/lite-on-inc/LTST-C191TBKT/160-1647-1-ND/573587; ComponentLink2URL: https://www.digikey.com/product-detail/en/lite-on-inc/LTST-C191TBKT/160-1647-1-ND/573587
D4 = DIODE_LED_ORANGE_0603: Manufacturer: Lite-On Inc.; Packaging: Cut Tape (CT); Part Status: Active; ComponentLink1URL: http://optoelectronics.liteon.com/upload/download/DS22-2000-228/LTST-C191KGKT.PDF; ComponentLink1Description: http://optoelectronics.liteon.com/upload/download/DS22-2000-228/LTST-C191KGKT.PDF; Supplier 1: Digi-Key; Supplier Part Number 1: 160-1445-1-ND; Category: Optoelectronics; Stock 1: 146932; Pricing 1: 1=0.34, 10=0.253, 25=0.1872, 100=0.1353 (USD); ComponentLink2Description: https://www.digikey.com/product-detail/en/lite-on-inc/LTST-C191KFKT/160-1445-1-ND/386832; ComponentLink2URL: https://www.digikey.com/product-detail/en/lite-on-inc/LTST-C191KFKT/160-1445-1-ND/386832
D5 = DIODE_LED_GREEN_0603: Manufacturer: Lite-On Inc.; Packaging: Cut Tape (CT); Part Status: Active; ComponentLink1URL: http://optoelectronics.liteon.com/upload/download/DS22-2000-228/LTST-C191KGKT.PDF; ComponentLink1Description: http://optoelectronics.liteon.com/upload/download/DS22-2000-228/LTST-C191KGKT.PDF; Supplier 1: Digi-Key; Supplier Part Number 1: 160-1446-1-ND; Category: Optoelectronics; Stock 1: 2166001; Pricing 1: 1=0.34, 10=0.253, 25=0.1872, 100=0.1353 (USD); ComponentLink2Description: https://www.digikey.com/product-detail/en/lite-on-inc/LTST-C191KGKT/160-1446-1-ND/386834; ComponentLink2URL: https://www.digikey.com/product-detail/en/lite-on-inc/LTST-C191KGKT/160-1446-1-ND/386834
FB1 = IND_FERRITE_600@100M_300mA_0402: Manufacturer: Murata Electronics North America; Manufacturer Part Number: BLM15HG601SN1D; Packaging: Cut Tape (CT); Part Status: Active; Operating Temperature: -55°C ~ 125°C; Supplier 1: Digi-Key; Supplier Part Number 1: 490-3998-1-ND; Category: Inductors; Stock 1: 330529; Pricing 1: 1=0.19, 10=0.145, 25=0.1204, 50=0.1036, 100=0.0933, 250=0.0788, 500=0.0705, 1000=0.06013 (USD); ComponentLink1Description: https://www.digikey.com/products/en?keywords=490-3998-1-ND; ComponentLink1URL: https://www.digikey.com/products/en?keywords=490-3998-1-ND
J2 = CONN_JST_SH_10PIN_RA_SMT: as J23 on sheet 02_PAB; Packaging: Cut Tape (CT); Part Status: Active; Operating Temperature: -25°C ~ 85°C; Supplier 1: Digi-Key; Supplier Part Number 1: 455-1810-1-ND; Category: Connectors, Interconnects; Stock 1: 62595; Pricing 1: 1=1.06, 10=9.32, 100=0.8037, 500=0.65758, 1000=0.58452 (USD); ComponentLink1Description: https://www.digikey.com/products/en/connectors-interconnects/rectangular-connectors-headers-male-pins/314?k=SM10B-SRSS&k=&pkeyword=SM10B-SRSS&pv1989=0&sf=0&FV=ffe0013a%2C1c0002&quantity=&ColumnSort=0&page=1&pageSize=25; ComponentLink1URL: https://www.digikey.com/products/en/connectors-interconnects/rectangular-connectors-headers-male-pins/314?k=SM10B-SRSS&k=&pkeyword=SM10B-SRSS&pv1989=0&sf=0&FV=ffe0013a%2C1c0002&quantity=&ColumnSort=0&page=1&pageSize=25
M1-M4 M7-M9 = MOUNT_HOLE_2MM_3.6MM_8VIAS_TH: CATEGORY: Mechanical
M5 M6 = MOUNT_HOLE_1.2MM_TH: CATEGORY: Mechanical
R3 R7 R8 R12 R14 = RES_10K_1%_1/16W_0402: Manufacturer: Vishay Dale; Manufacturer Part Number: CRCW040210K0FKED; Packaging: Cut Tape (CT); Part Status: Active; Tolerance: ±1%; Operating Temperature: -55°C ~ 155°C; ComponentLink1URL: https://www.digikey.com/products/en?keywords=311-10.0KLRCT-ND; ComponentLink1Description: https://www.digikey.com/products/en?keywords=311-10.0KLRCT-ND; Supplier 1: Digi-Key; Supplier Part Number 1: 541-10.0KLCT-ND; Category: Resistors; Stock 1: 37996194; Pricing 1: 1=0.1, 10=0.014, 100=0.0056, 1000=0.00253, 2500=0.0022, 5000=0.00181 (USD); Power: 1/16W
R4 = RES_20K_1%_1/16W_0402: Manufacturer: Yageo; Manufacturer Part Number: RC0402FR-0720KL; Packaging: Cut Tape (CT); Part Status: Active; Tolerance: ±1%; Operating Temperature: -55°C ~ 155°C; Supplier 1: Digi-Key; Supplier Part Number 1: 311-20.0KLRCT-ND; Category: Resistors; Stock 1: 8493470; Pricing 1: 1=0.1, 10=0.014, 100=0.0056, 1000=0.00253, 2500=0.0022, 5000=0.00181 (USD); Power: 1/16W; ComponentLink1Description: https://www.digikey.com/products/en?keywords=311-20.0KLRCT-ND; ComponentLink1URL: https://www.digikey.com/products/en?keywords=311-20.0KLRCT-ND
R5 R6 = RES_220_1%_1/16W_0402: Manufacturer: Yageo; Manufacturer Part Number: RC0402FR-07220RL; Category: Resistors; Packaging: Cut Tape (CT); Part Status: Active; Tolerance: ±1%; Power: 1/16W; Operating Temperature: -55°C ~ 155°C; ComponentLink1URL: https://www.digikey.com/products/en/resistors/chip-resistor-surface-mount/52?k=RC0402FR-07220RL&k=&pkeyword=RC0402FR-07220RL&pv7=2&sf=0&quantity=&ColumnSort=0&page=1&pageSize=25; ComponentLink1Description: https://www.digikey.com/products/en/resistors/chip-resistor-surface-mount/52?k=RC0402FR-07220RL&k=&pkeyword=RC0402FR-07220RL&pv7=2&sf=0&quantity=&ColumnSort=0&page=1&pageSize=25; Supplier 1: Digi-Key; Supplier Part Number 1: 311-220LRCT-ND; Stock 1: 897942; Pricing 1: 1=0.1, 10=0.014, 100=0.0056, 1000=0.00253, 2500=0.0022, 5000=0.00181 (USD)
R9 = RES_1K5_1%_1/16W_0402: Manufacturer: Yageo; Manufacturer Part Number: RC0402FR-071K5L; Packaging: Cut Tape (CT); Part Status: Active; Tolerance: ±1%; Operating Temperature: -55°C ~ 155°C; Supplier 1: Digi-Key; Supplier Part Number 1: 311-1.50KLRCT-ND; Category: Resistors; Stock 1: 2210206; Pricing 1: 1=0.1, 10=0.014, 100=0.0056, 1000=0.00253, 2500=0.0022, 5000=0.00181 (USD); Power: 1/16W; ComponentLink1Description: https://www.digikey.com/products/en/resistors/chip-resistor-surface-mount/52?k=RC0402FR-071K5L&k=&pkeyword=RC0402FR-071K5L&pv7=2&sf=0&quantity=&ColumnSort=0&page=1&pageSize=25; ComponentLink1URL: https://www.digikey.com/products/en/resistors/chip-resistor-surface-mount/52?k=RC0402FR-071K5L&k=&pkeyword=RC0402FR-071K5L&pv7=2&sf=0&quantity=&ColumnSort=0&page=1&pageSize=25
R10 R11 = RES_2K2_1%_1/16W_0402: Manufacturer: Yageo; Manufacturer Part Number: RC0402FR-072K2L; Packaging: Cut Tape (CT); Part Status: Active; Tolerance: ±1%; Operating Temperature: -55°C ~ 155°C; Supplier 1: Digi-Key; Supplier Part Number 1: 311-2.20KLRCT-ND; Category: Resistors; Stock 1: 4729817; Pricing 1: 1=0.1, 10=0.014, 100=0.0056, 1000=0.00253, 2500=0.0022, 5000=0.00181 (USD); Power: 1/16W; ComponentLink1Description: https://www.digikey.com/product-detail/en/yageo/RC0402FR-072K2L/311-2.20KLRCT-ND/729500; ComponentLink1URL: https://www.digikey.com/product-detail/en/yageo/RC0402FR-072K2L/311-2.20KLRCT-ND/729500
R13 = RES_100K_1%_1/16W_0402: Manufacturer: Yageo; Manufacturer Part Number: RC0402FR-07100KL; Packaging: Cut Tape (CT); Part Status: Active; Tolerance: ±1%; Operating Temperature: -55°C ~ 155°C; Supplier 1: Digi-Key; Supplier Part Number 1: 311-100KLRCT-ND; Category: Resistors; Stock 1: 16720425; Pricing 1: 1=0.1, 10=0.014, 100=0.0056, 1000=0.00253, 2500=0.0022, 5000=0.00181 (USD); Power: 1/16W; ComponentLink1Description: https://www.digikey.com/products/en/resistors/chip-resistor-surface-mount/52?k=RC0402FR-07100KL&k=&pkeyword=RC0402FR-07100KL&pv7=2&sf=0&quantity=&ColumnSort=0&page=1&pageSize=25; ComponentLink1URL: https://www.digikey.com/products/en/resistors/chip-resistor-surface-mount/52?k=RC0402FR-07100KL&k=&pkeyword=RC0402FR-07100KL&pv7=2&sf=0&quantity=&ColumnSort=0&page=1&pageSize=25
TP2-TP9 = TESTPOINT_PAD_SMD: CATEGORY: Test and Measurement; Manufacturer: N/A
U1 = IC_STM32F103C8T7: Manufacturer: STMicroelectronics; Core Processor: ARM® Cortex®-M3; Core Size: 32-Bit; Speed: 72MHz; Connectivity: CAN, I²C, IrDA, LIN, SPI, UART/USART, USB; Peripherals: DMA, Motor Control PWM, PDR, POR, PVD, PWM, Temp Sensor, WDT; Number of I/O: 37; Program Memory Size: 64KB (64K x 8); RAM Size: 20K x 8; Voltage - Supply (Vcc/Vdd): 2 V ~ 3.6 V; Data Converters: A/D 10x12b; Oscillator Type: Internal; RoHS: RoHS Compliant; Packaging: Tray; Part Status: Active; Program Memory Type: FLASH; EEPROM Size: -; Operating Temperature: -40°C ~ 105°C (TA); Package / Case: 48-LQFP; Supplier Device Package: 48-LQFP (7x7); Supplier 1: Digi-Key; Supplier Part Number 1: 497-11517-ND; Category: Integrated Circuits (ICs); Stock 1: 2415; Pricing 1: 1=5.05, 10=4.536, 250=3.52556, 500=3.16346, 1000=2.66798  (USD); ComponentLink1Description: https://www.digikey.com/product-detail/en/stmicroelectronics/STM32F103C8T7/497-11517-ND/2214603; ComponentLink1URL: https://www.digikey.com/product-detail/en/stmicroelectronics/STM32F103C8T7/497-11517-ND/2214603
X1 = XTAL_24MHZ_4-SMD: Manufacturer: Kyocera International Inc. Electronic Components; Manufacturer Part Number: CX3225SB24000D0FLJCC; Frequency Stability: ±15ppm; Frequency Tolerance: ±10ppm; Packaging: Cut Tape (CT); Part Status: Active; Load Capacitance: 8pF; Operating Temperature: -30°C ~ 85°C; Supplier 1: Digi-Key; Supplier Part Number 1: 1253-1745-1-ND; Category: Crystals, Oscillators, Resonators; Stock 1: 4069; Pricing 1: 1=0.73, 10=0.605, 50=0.5446, 100=0.484, 500=0.4598, 1000=0.3872 (USD); ComponentLink1Description: https://www.digikey.com/products/en?keywords=1253-1745-1-ND; ComponentLink1URL: https://www.digikey.com/products/en?keywords=1253-1745-1-ND